# EAGLE design dual_brushed_rc_2 (EAGLE 6.6.0)

## Sheet 1 of 8
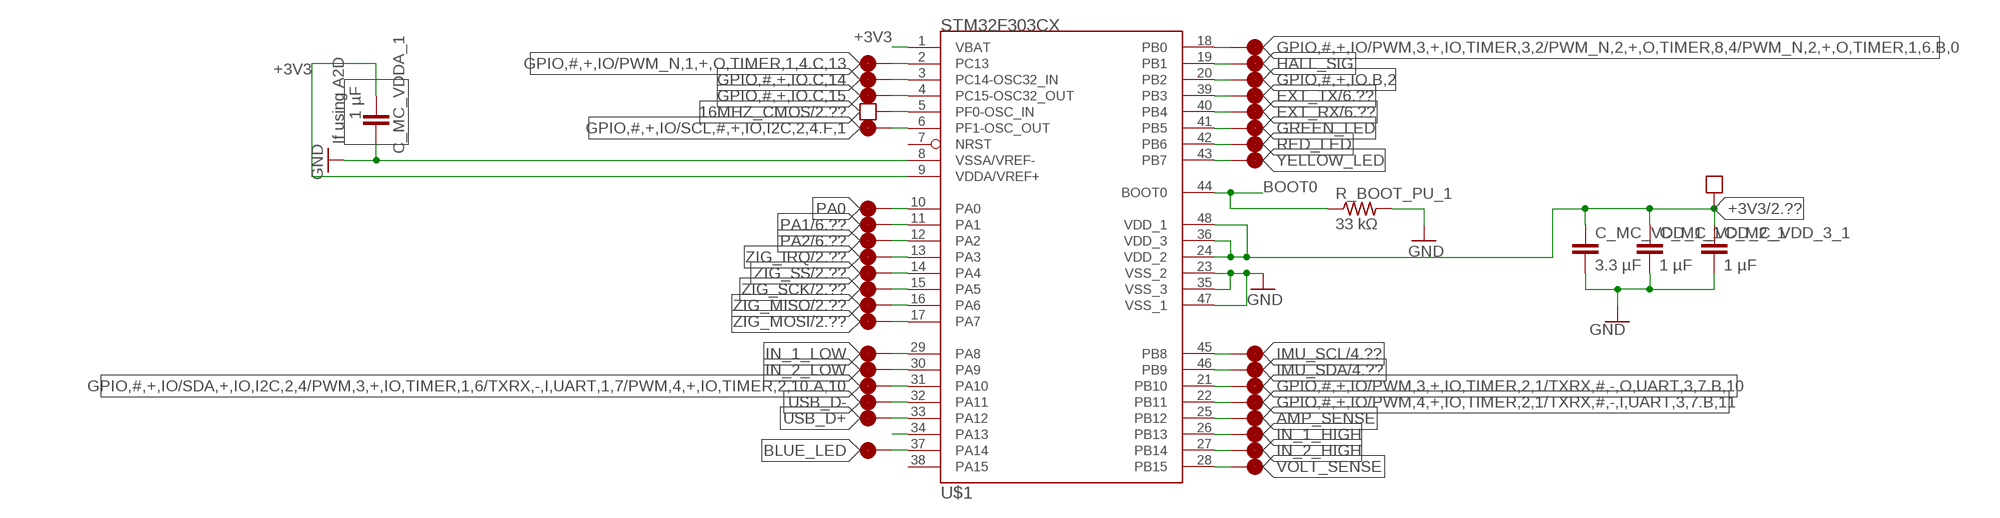
[diagram p0: schematic, sheet 1]

### Parts
C_MC_VDD_1_1  3.3 µF  C-EUC0603  [C0603]
C_MC_VDD_2_1  1 µF  C-EUC0402  [C0402]
C_MC_VDD_3_1  1 µF  C-EUC0402  [C0402]
C_MC_VDDA_1  1 µF  C-EUC0402  [C0402]
R_BOOT_PU_1  33 kΩ  R-US_R0402  [R0402]
U$1  STM32F303CX  [LQFP48]

### Nets
16MHZ_CMOS: U$1.5(PF0-OSC_IN) ; supply symbol labelled BLOCK_REQUIREMENT ; also sheet 2,3
+3V3: C_MC_VDD_1_1.1 C_MC_VDD_2_1.1 C_MC_VDD_3_1.1 C_MC_VDDA_1.1 U$1.1(VBAT) U$1.9(VDDA/VREF+) U$1.24(VDD_2) U$1.36(VDD_3) U$1.48(VDD_1) ; supply symbol labelled BLOCK_REQUIREMENT ; also sheet 2,3,4,5,6
AMP_SENSE: U$1.25(PB12) ; supply symbol labelled BLOCK_CONNECTOR ; also sheet 5
BLUE_LED: U$1.37(PA14) ; supply symbol labelled BLOCK_CONNECTOR ; also sheet 8
BOOT0: R_BOOT_PU_1.1 U$1.44(BOOT0) ; also sheet 7
EXT_RX: U$1.40(PB4) ; supply symbol labelled BLOCK_CONNECTOR ; also sheet 6
EXT_TX: U$1.39(PB3) ; supply symbol labelled BLOCK_CONNECTOR ; also sheet 6
GND: C_MC_VDD_1_1.2 C_MC_VDD_2_1.2 C_MC_VDD_3_1.2 C_MC_VDDA_1.2 R_BOOT_PU_1.2 U$1.8(VSSA/VREF-) U$1.23(VSS_2) U$1.35(VSS_3) U$1.47(VSS_1) ; also sheet 2,3,4,5,6,7,8
GPIO,#,+,IO.B,2: U$1.20(PB2) ; supply symbol labelled BLOCK_CONNECTOR
GPIO,#,+,IO.C,14: U$1.3(PC14-OSC32_IN) ; supply symbol labelled BLOCK_CONNECTOR
GPIO,#,+,IO.C,15: U$1.4(PC15-OSC32_OUT) ; supply symbol labelled BLOCK_CONNECTOR
GPIO,#,+,IO/PWM,3,+,IO,TIMER,2,1/TXRX,#,-,O,UART,3,7.B,10: U$1.21(PB10) ; supply symbol labelled BLOCK_CONNECTOR
GPIO,#,+,IO/PWM,3,+,IO,TIMER,3,2/PWM_N,2,+,O,TIMER,8,4/PWM_N,2,+,O,TIMER,1,6.B,0: U$1.18(PB0) ; supply symbol labelled BLOCK_CONNECTOR
GPIO,#,+,IO/PWM,4,+,IO,TIMER,2,1/TXRX,#,-,I,UART,3,7.B,11: U$1.22(PB11) ; supply symbol labelled BLOCK_CONNECTOR
GPIO,#,+,IO/PWM_N,1,+,O,TIMER,1,4.C,13: U$1.2(PC13) ; supply symbol labelled BLOCK_CONNECTOR
GPIO,#,+,IO/SCL,#,+,IO,I2C,2,4.F,1: U$1.6(PF1-OSC_OUT) ; supply symbol labelled BLOCK_CONNECTOR
GPIO,#,+,IO/SDA,+,IO,I2C,2,4/PWM,3,+,IO,TIMER,1,6/TXRX,-,I,UART,1,7/PWM,4,+,IO,TIMER,2,10.A,10: U$1.31(PA10) ; supply symbol labelled BLOCK_CONNECTOR
GREEN_LED: U$1.41(PB5) ; supply symbol labelled BLOCK_CONNECTOR ; also sheet 8
HALL_SIG: U$1.19(PB1) ; supply symbol labelled BLOCK_CONNECTOR ; also sheet 6
IMU_SCL: U$1.45(PB8) ; supply symbol labelled BLOCK_CONNECTOR ; also sheet 4
IMU_SDA: U$1.46(PB9) ; supply symbol labelled BLOCK_CONNECTOR ; also sheet 4
IN_1_HIGH: U$1.26(PB13) ; supply symbol labelled BLOCK_CONNECTOR ; also sheet 5
IN_1_LOW: U$1.29(PA8) ; supply symbol labelled BLOCK_CONNECTOR ; also sheet 5
IN_2_HIGH: U$1.27(PB14) ; supply symbol labelled BLOCK_CONNECTOR ; also sheet 5
IN_2_LOW: U$1.30(PA9) ; supply symbol labelled BLOCK_CONNECTOR ; also sheet 5
N$15: U$1.34(PA13)
PA0: U$1.10(PA0) ; supply symbol labelled BLOCK_CONNECTOR
PA1: U$1.11(PA1) ; supply symbol labelled BLOCK_CONNECTOR ; also sheet 6
PA2: U$1.12(PA2) ; supply symbol labelled BLOCK_CONNECTOR ; also sheet 6
RED_LED: U$1.42(PB6) ; supply symbol labelled BLOCK_CONNECTOR ; also sheet 8
USB_D+: U$1.33(PA12) ; supply symbol labelled BLOCK_CONNECTOR ; also sheet 7
USB_D-: U$1.32(PA11) ; supply symbol labelled BLOCK_CONNECTOR ; also sheet 7
VOLT_SENSE: U$1.28(PB15) ; supply symbol labelled BLOCK_CONNECTOR ; also sheet 6
YELLOW_LED: U$1.43(PB7) ; supply symbol labelled BLOCK_CONNECTOR ; also sheet 8
ZIG_IRQ: U$1.13(PA3) ; supply symbol labelled BLOCK_CONNECTOR ; also sheet 2
ZIG_MISO: U$1.16(PA6) ; supply symbol labelled BLOCK_CONNECTOR ; also sheet 2
ZIG_MOSI: U$1.17(PA7) ; supply symbol labelled BLOCK_CONNECTOR ; also sheet 2
ZIG_SCK: U$1.15(PA5) ; supply symbol labelled BLOCK_CONNECTOR ; also sheet 2
ZIG_SS: U$1.14(PA4) ; supply symbol labelled BLOCK_CONNECTOR ; also sheet 2
Unconnected: U$1.7(NRST) U$1.38(PA15)

### Notes on the sheet
- If using A2D

## Sheet 2 of 8
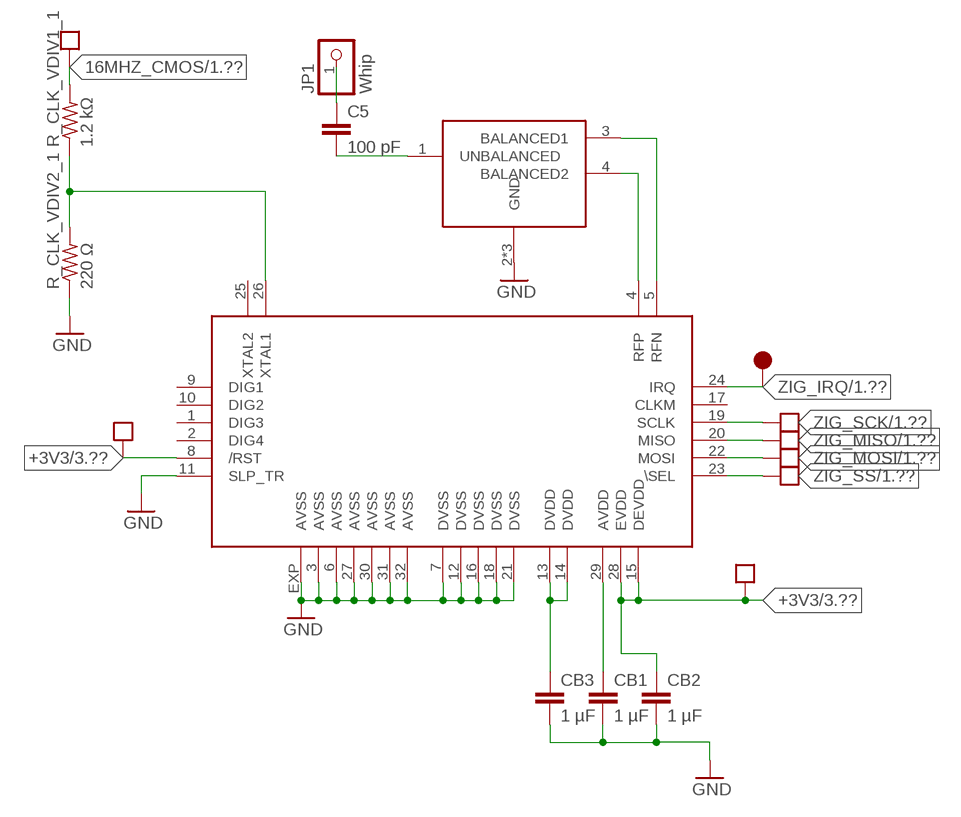
[diagram p1: schematic, sheet 2]

### Parts
BALUN1  0896FB15A0100  [0896FB15A0100]
C5  100 pF  C-EUC0402  [C0402]
CB1  1 µF  C-EUC0402  [C0402]
CB2  1 µF  C-EUC0402  [C0402]
CB3  1 µF  C-EUC0402  [C0402]
JP1  Whip  PINHD-1X01_2.54  [1X01]
R_CLK_VDIV1_1  1.2 kΩ  R-US_R0402  [R0402]
R_CLK_VDIV2_1  220 Ω  R-US_R0402  [R0402]
U$51  AT86RF  [QFNN32]

### Nets
16MHZ_0V5_1: R_CLK_VDIV1_1.1 R_CLK_VDIV2_1.2 U$51.26(XTAL1)
16MHZ_CMOS: R_CLK_VDIV1_1.2 ; supply symbol labelled BLOCK_REQUIREMENT ; also sheet 1,3
+3V3: CB2.1 U$51.8(/RST) U$51.15(DEVDD) U$51.28(EVDD) ; supply symbol labelled BLOCK_REQUIREMENT ; also sheet 1,3,4,5,6
GND: BALUN1.2(GND) BALUN1.5(GND) BALUN1.6(GND) CB1.2 CB2.2 CB3.2 R_CLK_VDIV2_1.1 U$51.3(AVSS) U$51.6(AVSS) U$51.7(DVSS) U$51.11(SLP_TR) U$51.12(DVSS) U$51.16(DVSS) U$51.18(DVSS) U$51.21(DVSS) U$51.27(AVSS) U$51.30(AVSS) U$51.31(AVSS) U$51.32(AVSS) U$51.EXP(AVSS) ; also sheet 1,3,4,5,6,7,8
N$2: BALUN1.1(UNBALANCED) C5.2
N$3: C5.1 JP1.1
N$4: CB3.1 U$51.13(DVDD) U$51.14(DVDD)
N$6: CB1.1 U$51.29(AVDD)
N$8: BALUN1.4(BALANCED2) U$51.4(RFP)
N$9: BALUN1.3(BALANCED1) U$51.5(RFN)
ZIG_IRQ: U$51.24(IRQ) ; supply symbol labelled BLOCK_CONNECTOR ; also sheet 1
ZIG_MISO: U$51.20(MISO) ; supply symbol labelled BLOCK_REQUIREMENT ; also sheet 1
ZIG_MOSI: U$51.22(MOSI) ; supply symbol labelled BLOCK_REQUIREMENT ; also sheet 1
ZIG_SCK: U$51.19(SCLK) ; supply symbol labelled BLOCK_REQUIREMENT ; also sheet 1
ZIG_SS: U$51.23(\SEL) ; supply symbol labelled BLOCK_REQUIREMENT ; also sheet 1
Unconnected: U$51.1(DIG3) U$51.2(DIG4) U$51.9(DIG1) U$51.10(DIG2) U$51.17(CLKM) U$51.25(XTAL2)

## Sheet 3 of 8
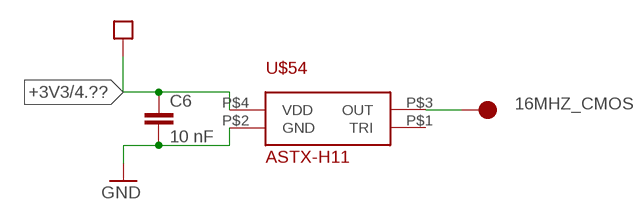
[diagram p2: schematic, sheet 3]

### Parts
C6  10 nF  C-EUC0402  [C0402]
U$54  ASTX-H11  [ASTX-H11]

### Nets
16MHZ_CMOS: U$54.P$3(OUT) ; supply symbol labelled BLOCK_CONNECTOR ; also sheet 1,2
+3V3: C6.1 U$54.P$4(VDD) ; supply symbol labelled BLOCK_REQUIREMENT ; also sheet 1,2,4,5,6
GND: C6.2 U$54.P$2(GND) ; also sheet 1,2,4,5,6,7,8
Unconnected: U$54.P$1(TRI)

## Sheet 4 of 8: IMU
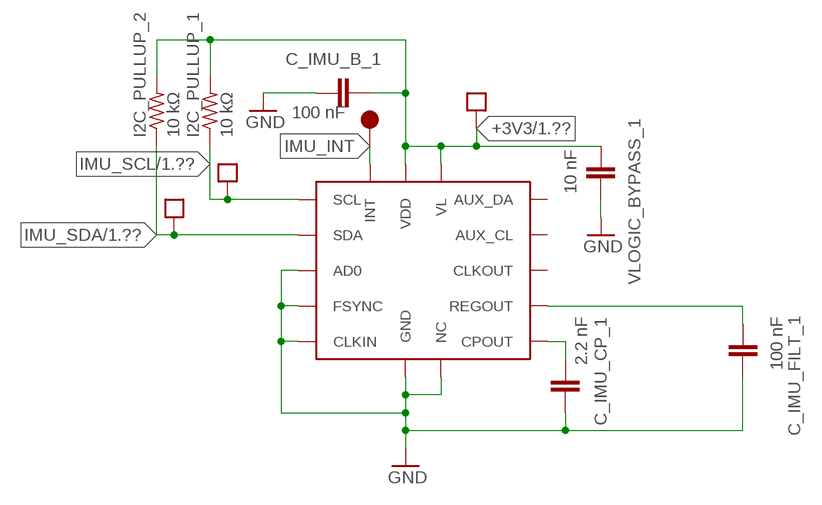
[diagram p3: schematic, sheet 4]

### Parts
C_IMU_B_1  100 nF  C-EUC0402  [C0402]
C_IMU_CP_1  2.2 nF  C-EUC0402  [C0402]
C_IMU_FILT_1  100 nF  C-EUC0402  [C0402]
I2C_PULLUP_1  10 kΩ  R-US_R0402  [R0402]
I2C_PULLUP_2  10 kΩ  R-US_R0402  [R0402]
U$46  MPU-6050  [QFN24]
VLOGIC_BYPASS_1  10 nF  C-EUC0402  [C0402]

### Nets
+3V3: C_IMU_B_1.1 I2C_PULLUP_1.2 I2C_PULLUP_2.2 U$46.P$8(VL) U$46.P$13(VDD) VLOGIC_BYPASS_1.1 ; supply symbol labelled BLOCK_REQUIREMENT ; also sheet 1,2,3,5,6
GND: C_IMU_B_1.2 C_IMU_CP_1.2 C_IMU_FILT_1.2 U$46.P$1(CLKIN) U$46.P$2(NC) U$46.P$3(NC) U$46.P$4(NC) U$46.P$5(NC) U$46.P$9(AD0) U$46.P$11(FSYNC) U$46.P$14(NC) U$46.P$15(NC) U$46.P$16(NC) U$46.P$17(NC) U$46.P$18(GND) U$46.P$25(GND) VLOGIC_BYPASS_1.2 ; also sheet 1,2,3,5,6,7,8
IMU_INT: U$46.P$12(INT) ; supply symbol labelled BLOCK_CONNECTOR
IMU_SCL: I2C_PULLUP_1.1 U$46.P$23(SCL) ; supply symbol labelled BLOCK_REQUIREMENT ; also sheet 1
IMU_SDA: I2C_PULLUP_2.1 U$46.P$24(SDA) ; supply symbol labelled BLOCK_REQUIREMENT ; also sheet 1
N$5: C_IMU_CP_1.1 U$46.P$20(CPOUT)
REGOUT_1: C_IMU_FILT_1.1 U$46.P$10(REGOUT)
Unconnected: U$46.P$6(AUX_DA) U$46.P$7(AUX_CL) U$46.P$22(CLKOUT)

## Sheet 5 of 8
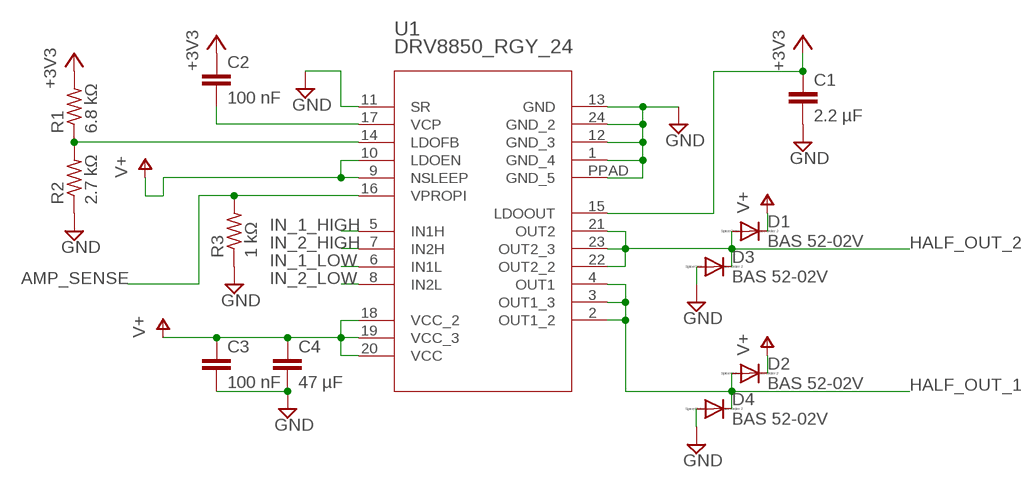
[diagram p4: schematic, sheet 5]

### Parts
C1  2.2 µF  C-EUC0603  [C0603]
C2  100 nF  C-EUC0402  [C0402]
C3  100 nF  C-EUC0402  [C0402]
C4  47 µF  C-EUC0805  [C0805]
D1  BAS 52-02V  DIODE-SOD523  [SOD523]
D2  BAS 52-02V  DIODE-SOD523  [SOD523]
D3  BAS 52-02V  DIODE-SOD523  [SOD523]
D4  BAS 52-02V  DIODE-SOD523  [SOD523]
R1  6.8 kΩ  R-US_R0402  [R0402]
R2  2.7 kΩ  R-US_R0402  [R0402]
R3  1 kΩ  R-US_R0402  [R0402]
U1  DRV8850_RGY_24  [RGY_24]

### Nets
+3V3: C1.1 C2.1 R1.2 U1.15(LDOOUT) ; also sheet 1,2,3,4,6
AMP_SENSE: R3.2 U1.16(VPROPI) ; also sheet 1
GND: C1.2 C3.2 C4.2 D3.A D4.A R2.1 R3.1 U1.1(GND_4) U1.11(SR) U1.12(GND_3) U1.13(GND) U1.24(GND_2) U1.PPAD(GND_5) ; also sheet 1,2,3,4,6,7,8
HALF_OUT_1: D2.A D4.C U1.2(OUT1_2) U1.3(OUT1_3) U1.4(OUT1) ; also sheet 6
HALF_OUT_2: D1.A D3.C U1.21(OUT2) U1.22(OUT2_2) U1.23(OUT2_3) ; also sheet 6
IN_1_HIGH: U1.5(IN1H) ; also sheet 1
IN_1_LOW: U1.6(IN1L) ; also sheet 1
IN_2_HIGH: U1.7(IN2H) ; also sheet 1
IN_2_LOW: U1.8(IN2L) ; also sheet 1
N$1: R1.1 R2.2 U1.14(LDOFB)
N$7: C2.2 U1.17(VCP)
V+: C3.1 C4.1 D1.C D2.C U1.9(NSLEEP) U1.10(LDOEN) U1.18(VCC_2) U1.19(VCC_3) U1.20(VCC) ; also sheet 6,7

## Sheet 6 of 8
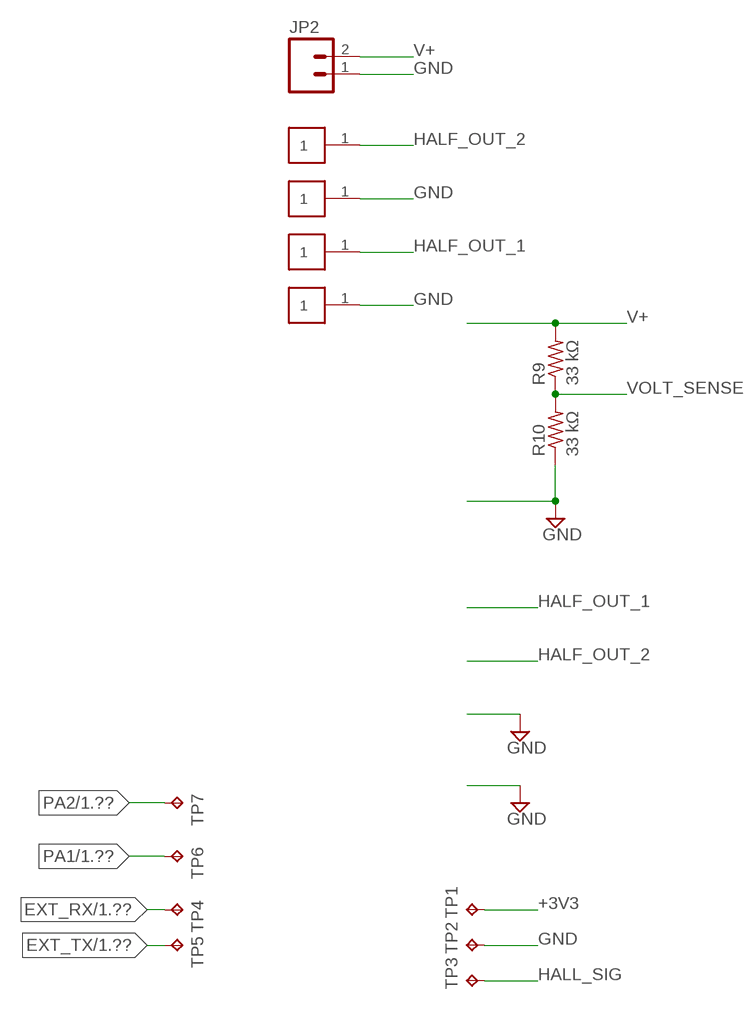
[diagram p5: schematic, sheet 6]

### Parts
JP2  M02-JST-2-PTH-NO_SILK  [JST-2-PTH-NS]
R9  33 kΩ  R-US_R0402  [R0402]
R10  33 kΩ  R-US_R0402  [R0402]
TP1  TPTP10SQ  [TP10SQ]
TP2  TPTP10SQ  [TP10SQ]
TP3  TPTP10SQ  [TP10SQ]
TP4  TPTP10SQ  [TP10SQ]
TP5  TPTP10SQ  [TP10SQ]
TP6  TPTP10SQ  [TP10SQ]
TP7  TPTP10SQ  [TP10SQ]
U$55  PADSURF  [PAD_1_SURF]
U$58  PADSURF  [PAD_1_SURF]
U$59  PADSURF  [PAD_1_SURF]
U$60  PADSURF  [PAD_1_SURF]

### Nets
+3V3: TP1.TP ; also sheet 1,2,3,4,5
EXT_RX: TP4.TP ; also sheet 1
EXT_TX: TP5.TP ; also sheet 1
GND: JP2.1 R10.1 TP2.TP U$59.1 U$60.1 ; also sheet 1,2,3,4,5,7,8
HALF_OUT_1: U$58.1 ; also sheet 5
HALF_OUT_2: U$55.1 ; also sheet 5
HALL_SIG: TP3.TP ; also sheet 1
PA1: TP6.TP ; also sheet 1
PA2: TP7.TP ; also sheet 1
V+: JP2.2 R9.2 ; also sheet 5,7
VOLT_SENSE: R9.1 R10.2 ; also sheet 1

## Sheet 7 of 8
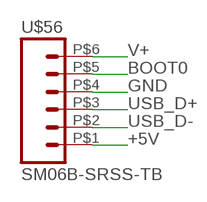
[diagram p6: schematic, sheet 7]

### Parts
U$56  SM06B-SRSS-TB  [SM06B-SRSS-TB]

### Nets
+5V: U$56.P$1
BOOT0: U$56.P$5 ; also sheet 1
GND: U$56.P$4 ; also sheet 1,2,3,4,5,6,8
USB_D+: U$56.P$3 ; also sheet 1
USB_D-: U$56.P$2 ; also sheet 1
V+: U$56.P$6 ; also sheet 5,6

## Sheet 8 of 8
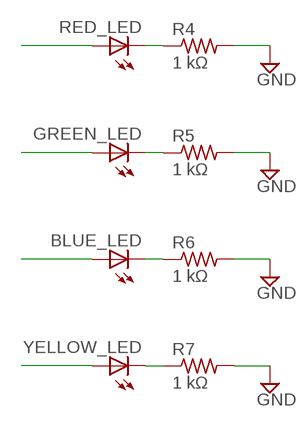
[diagram p7: schematic, sheet 8]

### Parts
BLUE_LED  LEDCHIPLED_0603  [CHIPLED_0603]
GREEN_LED  LEDCHIPLED_0603  [CHIPLED_0603]
R4  1 kΩ  R-US_R0402  [R0402]
R5  1 kΩ  R-US_R0402  [R0402]
R6  1 kΩ  R-US_R0402  [R0402]
R7  1 kΩ  R-US_R0402  [R0402]
RED_LED  LEDCHIPLED_0603  [CHIPLED_0603]
YELLOW_LED  LEDCHIPLED_0603  [CHIPLED_0603]

### Nets
BLUE_LED: BLUE_LED.A ; also sheet 1
GND: R4.2 R5.2 R6.2 R7.2 ; also sheet 1,2,3,4,5,6,7
GREEN_LED: GREEN_LED.A ; also sheet 1
N$10: R4.1 RED_LED.C
N$12: GREEN_LED.C R5.1
N$14: BLUE_LED.C R6.1
N$17: R7.1 YELLOW_LED.C
RED_LED: RED_LED.A ; also sheet 1
YELLOW_LED: YELLOW_LED.A ; also sheet 1

## Library data of the parts
BALUN1 = piccoli:0896FB15A0100
BLUE_LED GREEN_LED RED_LED YELLOW_LED = led:LED: LED OSRAM: - CHIPLED LG R971, LG N971, LY N971, LG Q971, LY Q971, LO R971, LY R971 LH N974, LH R974 LS Q976, LO Q976, LY Q976 LO Q996 - Hyper CHIPLED LW Q18S LB Q993, LB Q99A, LB R99A - SideLED LS A670, LO A670, LY A670, LG A670, LP A670 LB A673, LV A673, LT A673, LW A673 LH A674 LY A675 LS A676, LA A676, LO A676, LY A676, LW A676 LS A679, LY A679, LG A679 - Hyper Micro SIDELED® LS Y876, LA Y876, LO Y876, LY Y876 LT Y87S - SmartLED LW L88C, LW L88S LB L89C, LB L89S, LG L890 LS L89K, LO L89K, LY L89K LS L896, LA L896, LO L896, LY L896 - TOPLED LS T670, LO T670, LY T670, LG T670, LP T670 LSG T670, LSP T670, LSY T670, LOP T670, LYG T670 LG T671, LOG T671, LSG T671 LB T673, LV T673, LT T673, LW T673 LH T674 LS T676, LA T676, LO T676, LY T676, LB T676, LH T676, LSB T676, LW T676 LB T67C, LV T67C, LT T67C, LS T67K, LO T67K, LY T67K, LW E67C LS E67B, LA E67B, LO E67B, LY E67B, LB E67C, LV E67C, LT E67C LW T67C LS T679, LY T679, LG T679 LS T770, LO T770, LY T770, LG T770, LP T770 LB T773, LV T773, LT T773, LW T773 LH T774 LS E675, LA E675, LY E675, LS T675 LS T776, LA T776, LO T776, LY T776, LB T776 LHGB T686 LT T68C, LB T68C - Hyper Mini TOPLED® LB M676 - Mini TOPLED Santana® LG M470 LS M47K, LO M47K, LY M47K Source: http://www.osram.convergy.de LUXEON: - LUMILED® LXK2-PW12-R00, LXK2-PW12-S00, LXK2-PW14-U00, LXK2-PW14-V00 LXK2-PM12-R00, LXK2-PM12-S00, LXK2-PM14-U00 LXK2-PE12-Q00, LXK2-PE12-R00, LXK2-PE12-S00, LXK2-PE14-T00, LXK2-PE14-U00 LXK2-PB12-K00, LXK2-PB12-L00, LXK2-PB12-M00, LXK2-PB14-N00, LXK2-PB14-P00, LXK2-PB14-Q00 LXK2-PR12-L00, LXK2-PR12-M00, LXK2-PR14-Q00, LXK2-PR14-R00 LXK2-PD12-Q00, LXK2-PD12-R00, LXK2-PD12-S00 LXK2-PH12-R00, LXK2-PH12-S00 LXK2-PL12-P00, LXK2-PL12-Q00, LXK2-PL12-R00 Source: www.luxeon.com KINGBRIGHT: KA-3528ASYC Source: www.kingbright.com
C1-C6 C_IMU_B_1 C_IMU_CP_1 C_IMU_FILT_1 C_MC_VDD_1_1 C_MC_VDD_2_1 C_MC_VDD_3_1 C_MC_VDDA_1 CB1-CB3 VLOGIC_BYPASS_1 = rcl:C-EU: CAPACITOR, European symbol
D1-D4 = diode:DIODE-: DIODE
I2C_PULLUP_1 I2C_PULLUP_2 R_BOOT_PU_1 R_CLK_VDIV1_1 R_CLK_VDIV2_1 = resistor:R-US_: RESISTOR, American symbol
JP1 = pinhead-2:PINHD-1X01: PIN HEADER
JP2 = SparkFun:M02: Header 2 Standard 2-pin 0.1" header. Use with straight break away headers (SKU : PRT-00116), right angle break away headers (PRT-00553), swiss pins (PRT-00743), machine pins (PRT-00117), and female headers (PRT-00115). Molex polarized connector foot print use with SKU : PRT-08233 with associated crimp pins and housings.
R1-R7 R9 R10 = rcl:R-US_: RESISTOR, American symbol
TP1-TP7 = testpad:TP: Test pad
U1 = block_parts:DRV8850_RGY_24: The DRV8850 from Texas Instruments is a Low-Voltage H-bridge IC With LDO Voltage Regulation.; MANUFACTURER_PART_NUMBER: drv8850_rgy_24; VENDOR: Texas Instruments
U$1 = piccoli:STM32F303CX
U$46 = zz-upenn 2:MPU-6050
U$51 = piccoli:AT86RF
U$54 = block_parts:ASTX-H11
U$55 U$58-U$60 = block_parts:PAD
U$56 = block_parts:SM06B-SRSS-TB

## Board
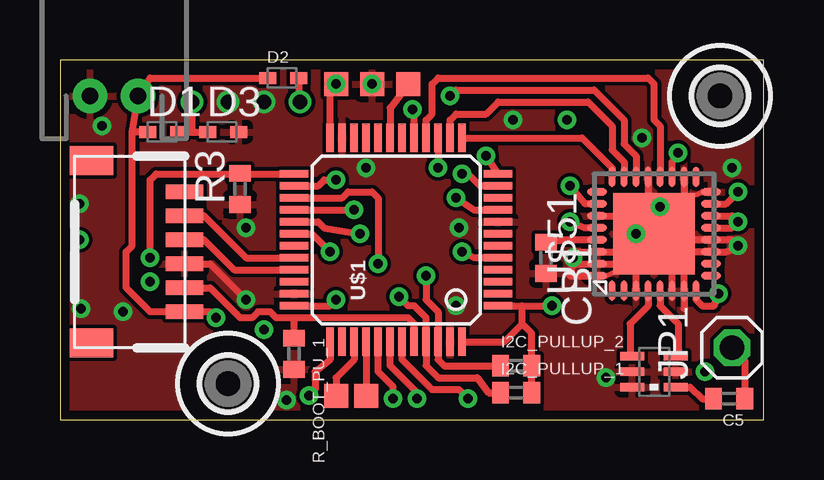
[diagram p8: board, top side]
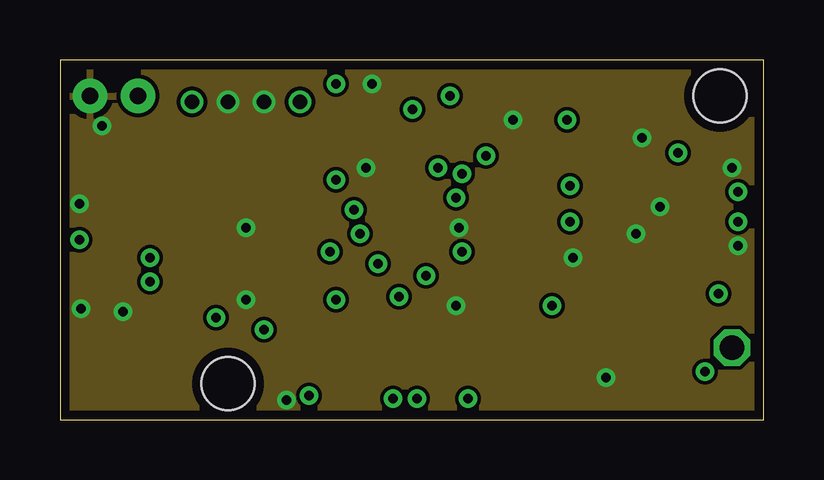
[diagram p9: board, inner layer Route2]
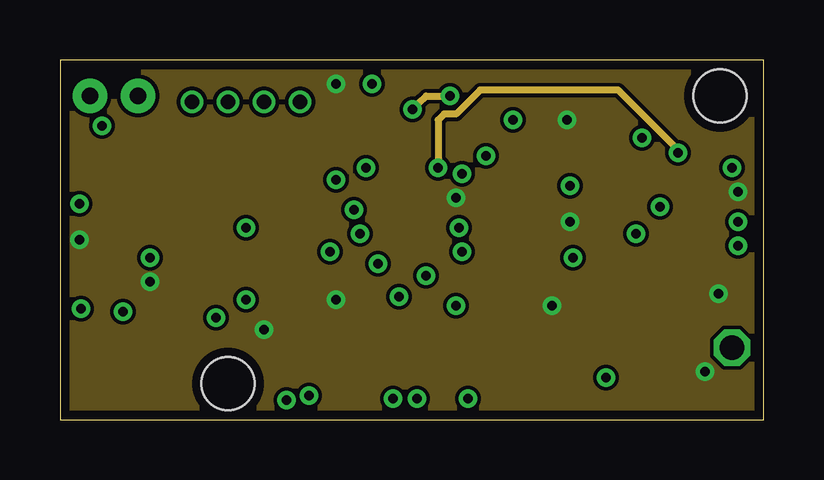
[diagram p10: board, inner layer Route15]
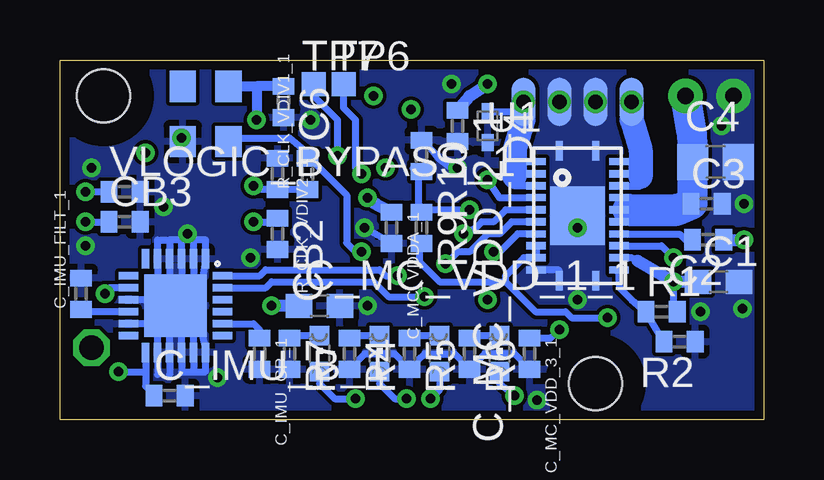
[diagram p11: board, bottom side, seen from below]

Size 29.31 x 15 mm. Coordinates in mm from the lower left corner, seen from the top.
Outline: 0,0 29.31,0 29.31,15 0,15 0,0
Copper layers (1*2+15*16): Top 0.0356mm / dielectric 1.5011mm / Route2 0.0356mm / dielectric 0.1499mm / Route15 0.0356mm / dielectric 0.2007mm / Bottom 0.0356mm
Design rules "OSH_Park_4-Layer_2014-10-10": minimum track width 6mil, minimum drill 13mil, track to track 6mil, track to pad 6mil, pad to pad 6mil, via to via 6mil, smd to smd 6mil, copper to edge 15mil, drill to drill 6mil, minimum pad ring 7mil, minimum via ring 7mil, stop-mask expansion 3mil, vias tented up to drill 0mil, thermal gap 10mil
tRestrict: area 24.2,3 to 25.2,4.2

### Footprints (pad centres in the part's own frame; a part is rotated, then mirrored left to right if it is on the bottom)
0896FB15A0100 = smd 0.35 x 1: 1 -0.65,-0.9; 2 0,-0.9; 3 0.65,-0.9; 4 0.65,0.9; 5 0,0.9; 6 -0.65,0.9
CHIPLED_0603 = smd 0.8 x 0.8: A 0,-0.75; C 0,0.75
C0603 = smd 1.1 x 1: 1 -0.85,0; 2 0.85,0
C0402 = smd 0.7 x 0.9: 1 -0.65,0; 2 0.65,0
C0805 = smd 1.3 x 1.5: 1 -0.95,0; 2 0.95,0
SOD523 = smd 0.7 x 0.5: A 0.7,0; C -0.6,0
R0402 = smd 0.7 x 0.9: 1 -0.65,0; 2 0.65,0
1X01 = drill 1.016 octagon: 1 0,0
JST-2-PTH-NS = drill 0.7 pad 1.448: 1 -1,0; 2 1,0
TP10SQ = smd 1 x 1: TP 0,0
RGY_24 = smd 0.305 x 0.813: 1 -0.762,2.718; 12 -0.762,-2.718; 13 0.762,-2.718; 24 0.762,2.718 | smd 0.813 x 0.305: 2 -1.727,2.261; 3 -1.727,1.753; 4 -1.727,1.245; 5 -1.727,0.762; 6 -1.727,0.254; 7 -1.727,-0.254; 8 -1.727,-0.762; 9 -1.727,-1.245; 10 -1.727,-1.753; 11 -1.727,-2.261; 14 1.727,-2.261; 15 1.727,-1.753; 16 1.727,-1.245; 17 1.727,-0.762; 18 1.727,-0.254; 19 1.727,0.254; 20 1.727,0.762; 21 1.727,1.245; 22 1.727,1.753; 23 1.727,2.261 | smd 2.26 x 2.44: PPAD 0,0
LQFP48 = smd 0.3 x 1.2: 1 -2.75,-4.25; 2 -2.25,-4.25; 3 -1.75,-4.25; 4 -1.25,-4.25; 5 -0.75,-4.25; 6 -0.25,-4.25; 7 0.25,-4.25; 8 0.75,-4.25; 9 1.25,-4.25; 10 1.75,-4.25; 11 2.25,-4.25; 12 2.75,-4.25; 25 2.75,4.25; 26 2.25,4.25; 27 1.75,4.25; 28 1.25,4.25; 29 0.75,4.25; 30 0.25,4.25; 31 -0.25,4.25; 32 -0.75,4.25; 33 -1.25,4.25; 34 -1.75,4.25; 35 -2.25,4.25; 36 -2.75,4.25 | smd 1.2 x 0.3: 13 4.25,-2.75; 14 4.25,-2.25; 15 4.25,-1.75; 16 4.25,-1.25; 17 4.25,-0.75; 18 4.25,-0.25; 19 4.25,0.25; 20 4.25,0.75; 21 4.25,1.25; 22 4.25,1.75; 23 4.25,2.25; 24 4.25,2.75; 37 -4.25,2.75; 38 -4.25,2.25; 39 -4.25,1.75; 40 -4.25,1.25; 41 -4.25,0.75; 42 -4.25,0.25; 43 -4.25,-0.25; 44 -4.25,-0.75; 45 -4.25,-1.25; 46 -4.25,-1.75; 47 -4.25,-2.25; 48 -4.25,-2.75
QFN24 = smd 0.3 x 0.8: P$1 -1.25,-1.955; P$2 -0.75,-1.955; P$3 -0.25,-1.955; P$4 0.25,-1.955; P$5 0.75,-1.955; P$6 1.25,-1.955; P$13 1.25,1.955; P$14 0.75,1.955; P$15 0.25,1.955; P$16 -0.25,1.955; P$17 -0.75,1.955; P$18 -1.25,1.955 | smd 0.8 x 0.3: P$7 1.955,-1.25; P$8 1.955,-0.75; P$9 1.955,-0.25; P$10 1.955,0.25; P$11 1.955,0.75; P$12 1.955,1.25; P$19 -1.955,1.25; P$20 -1.955,0.75; P$21 -1.955,0.25; P$22 -1.955,-0.25; P$23 -1.955,-0.75; P$24 -1.955,-1.25 | smd 2.6 x 2.6: P$25 0,0
QFNN32 = smd 0.85 x 0.3: 1 -2.375,1.75; 2 -2.375,1.25; 3 -2.375,0.75; 4 -2.375,0.25; 5 -2.375,-0.25; 6 -2.375,-0.75; 7 -2.375,-1.25; 8 -2.375,-1.75; 17 2.375,-1.75; 18 2.375,-1.25; 19 2.375,-0.75; 20 2.375,-0.25; 21 2.375,0.25; 22 2.375,0.75; 23 2.375,1.25; 24 2.375,1.75 | smd 0.3 x 0.85: 9 -1.75,-2.375; 10 -1.25,-2.375; 11 -0.75,-2.375; 12 -0.25,-2.375; 13 0.25,-2.375; 14 0.75,-2.375; 15 1.25,-2.375; 16 1.75,-2.375; 25 1.75,2.375; 26 1.25,2.375; 27 0.75,2.375; 28 0.25,2.375; 29 -0.25,2.375; 30 -0.75,2.375; 31 -1.25,2.375; 32 -1.75,2.375 | smd 3.4 x 3.4: EXP 0,0
M2_HOLE_PLASTIC = hole 2.2: 0,0
ASTX-H11 = smd 1.3 x 1.1: P$1 -1.15,-0.95; P$2 1.15,-0.95; P$3 1.15,0.95; P$4 -1.15,0.95
PAD_1_SURF = smd 2 x 1: 1 0,0
SM06B-SRSS-TB = smd 0.6 x 1.55: P$1 -2.5,0; P$2 -1.5,0; P$3 -0.5,0; P$4 0.5,0; P$5 1.5,0; P$6 2.5,0 | smd 1.2 x 1.8: P$7 3.8,-3.875; P$8 -3.8,-3.875

### Placement (x,y rotation side)
BALUN1  24.75,2 90 top
BLUE_LED  11,2.75 0 bottom
C1  1.88,5.75 0 bottom
C2  2.31,7.5 180 bottom
C3  2.38,9 0 bottom
C4  2,10.75 0 bottom
C5  27.88,0.88 180 top
C6  20,13.25 270 bottom
C_IMU_B_1  24.75,1 0 bottom
C_IMU_CP_1  21,2.75 270 bottom
C_IMU_FILT_1  28.44,5.25 90 bottom
C_MC_VDD_1_1  18.5,4.75 0 bottom
C_MC_VDD_2_1  12.75,12.25 270 bottom
C_MC_VDD_3_1  9.75,2.75 270 bottom
C_MC_VDDA_1  15.5,8 270 bottom
CB1  20.25,6.75 270 top
CB2  20.25,7.75 270 bottom
CB3  26.62,8.25 0 bottom
D1  4.25,12 0 top
D2  9.25,14.25 0 top
D3  6.75,12 0 top
D4  11.5,12.25 270 bottom
GREEN_LED  13.5,2.75 0 bottom
I2C_PULLUP_1  19,1.12 0 top
I2C_PULLUP_2  19,2.25 0 top
JP1  28,3 90 top
JP2  2.25,13.5 0 top
R1  4.25,4.5 0 bottom
R2  3.5,3.25 180 bottom
R3  7.5,9.62 90 top
R4  17.25,2.75 270 bottom
R5  14.75,2.75 270 bottom
R6  12.25,2.75 270 bottom
R7  19.75,2.75 270 bottom
R9  14.25,8 270 bottom
R10  14.25,11 270 bottom
R_BOOT_PU_1  9.75,2.75 270 top
R_CLK_VDIV1_1  19,10.25 90 bottom
R_CLK_VDIV2_1  20.25,10.25 270 bottom
RED_LED  16,2.75 0 bottom
TP1  11.5,14 0 top
TP2  13,14 0 top
TP3  14.5,14 0 top
TP4  12.75,1 0 top
TP5  11.5,1 0 top
TP6  17.5,14 0 bottom
TP7  18.75,14 0 bottom
U1  7.75,8.5 0 bottom
U$1  14,7.5 90 top
U$46  24.5,4.75 180 bottom
U$51  24.75,7.75 90 top
U$52  [M2_HOLE_PLASTIC]  27.5,13.5 0 top
U$54  23.25,12.75 270 bottom
U$55  5.5,13.25 90 bottom
U$56  5.19,7 270 top
U$57  [M2_HOLE_PLASTIC]  7,1.5 0 top
U$58  10,13.25 90 bottom
U$59  7,13.25 90 bottom
U$60  8.5,13.25 90 bottom
VLOGIC_BYPASS_1  26.62,9.5 0 bottom
YELLOW_LED  18.5,2.75 0 bottom

### Tracks (layer width: path | path; a pad name or v marks a point on that pad's centre or on a via)
16MHZ_0V5_1  (via drill 0.4)
  Top 0.3: U$51.26 21.88,9 v21.25,9.75
  Bottom 0.3: R_CLK_VDIV1_1.1 R_CLK_VDIV2_1.2 21.1,9.6 v21.25,9.75
16MHZ_CMOS  (via drill 0.4)
  Top 0.3: U$1.5 17.25,6.75 v16.75,7
  Bottom 0.3: U$54.P$3 22.3,11.75 19.75,11.75 19,11.12 R_CLK_VDIV1_1.2 18.75,10.75 17.38,9.38 17.38,7.38 17,7 v16.75,7
+3V3  (via drill 0.4)
  Top 0.3: U$51.8 26.5,5 26.75,4.75 27.25,4.75 v27.44,5.25 | v16.5,9.25 17.25,8.75 U$1.9 | U$51.28 21.88,8 v21.25,8.25 | U$1.36 11.25,4.75 v11.5,5 | U$1.24 11.25,13.75 TP1.TP | U$1.48 18.5,3.25 19.25,4 | U$1.1 19.25,4.75 | 19.25,4.75 v20.5,4.75 | 19.25,4 19.25,4.75 | I2C_PULLUP_1.2 I2C_PULLUP_2.2 19.65,3.6 19.25,4 | U$51.15 27.75,9 v28.25,9.5
  Bottom 0.3: 25.75,2 U$46.P$13 25.75,2.5 | 5.25,6.62 5.5,6.75 U1.15 | C_IMU_B_1.1 25.75,1.4 25.75,2 | U$46.P$8 27.25,5.5 v27.44,5.25 | v26.88,2 25.75,2 | v21.25,8.25 20.1,8.25 CB2.1 | VLOGIC_BYPASS_1.1 v28.25,9.5 | C_MC_VDD_3_1.1 8.88,3.4 v8.5,3.75 | R1.2 3.75,4.62 v3.75,5.75
  Bottom 0.406: C6.1 21.12,13.9 | 21.12,13.9 v21.12,12.5 | U$54.P$4 21.12,13.9
  Bottom 0.5: C_MC_VDD_1_1.1 v20.5,4.75 | C2.1 v0.81,7.5 | C1.1 v3.75,5.75 5.25,6.62 | C_MC_VDD_2_1.1 12.25,13.5 TP1.TP | v16.5,9.25 16.15,9 C_MC_VDDA_1.1
  other vias: 11.5,14
  pour Route15: -0.12,14.88 29.38,14.88 29.38,0.12 -0.12,0.12
AMP_SENSE  (via drill 0.4)
  Top 0.3: U$1.25 7.65,10.25 R3.2 7.47,10.25 4,10.25 3.75,10 v3.75,6.75
  Bottom 0.3: U1.16 6.27,7.25 4.25,7.25 v3.75,6.75
BLUE_LED  (via drill 0.4)
  Top 0.3: U$1.37 11.25,2.5 10.62,2 10.62,1.25 v10.38,1
  Bottom 0.3: BLUE_LED.A 11,1.5 v10.38,1
BOOT0
  Top 0.3: U$56.P$5 6.25,5.5 7.5,4.25 8,4.25 8.25,4.5 8.75,4.5 9,4.25 9.75,4.25 | U$1.44 14.75,4 14.5,4.25 9.75,4.25 | R_BOOT_PU_1.1 9.75,4.25
EXT_RX
  Top 0.3: U$1.40 TP4.TP
EXT_TX
  Top 0.3: U$1.39 12.25,2.5 11.5,1.75 TP5.TP
GND  (via drill 0.4, 0.6)
  Top 0.19: 22.75,6 23.25,6.25 | 26.75,9.5 26.5,9.38
  Top 0.2: U$51.32 22.75,6 | 23.25,6.25 23.25,6.5 | U$51.16 26.75,9.5 | 26.5,9.38 26,9.25
  Top 0.3: U$51.EXP 25,7.5 U$51.12 28,7.5 v28.25,7.25 27.75,7 U$51.11 25.5,7 | U$51.6 25.5,7 | 25.5,7 U$51.EXP | U$51.EXP 26,6.5 U$51.7 26,4.62 | U$51.3 24,7 | U$51.18 26,9.25 26,9 U$51.EXP | U$51.21 24.5,7.75 U$51.EXP | 24,7 U$51.30 21.5,7 21.38,6.88 v21.38,6.75 | U$51.27 24,8.5 U$51.EXP | 24,7 23.5,6.5 23.25,6.5 U$51.31 21.38,6.5 v21.38,6.75 | 24,7 U$51.EXP | v21.38,6.75 21.25,6 U$51.32 | U$56.P$4 6.25,6.5 v7.75,5
  Bottom 0.3: 24.75,5 U$46.P$9 | U$46.P$16 24.25,4.5 U$46.P$25 | U$46.P$16 24.25,4 U$46.P$11 | 8.51,6.24 U1.11 | U$46.P$16 24.25,2 23.75,2 | 23.75,2 23.25,2 U$46.P$18 23.25,3 23.5,4 24.5,4.5 U$46.P$25 | 23.75,2 U$46.P$17 23.75,4 U$46.P$25 | U$46.P$25 25.25,5.5 U$46.P$5 25.25,7.5 24.75,7.5 | U$46.P$4 24.75,5 | 24.75,5 U$46.P$25 | U$46.P$25 24.25,5 U$46.P$3 24.25,7.5 | U$46.P$25 23.75,5.5 U$46.P$2 23.75,7.5 | U$46.P$25 24.5,5 23.5,5.25 U$46.P$1 23.25,7.5 23.75,7.5 | 24.75,7.5 24.75,6.75 | 24.25,7.5 24.75,7.5 | 23.75,7.5 24.25,7.5 | 24.75,4.5 U$46.P$15 24.75,1.88 | 24.75,4.5 25.25,4 U$46.P$14 25.25,1.88 | 24.75,4.5 U$46.P$25 | R_BOOT_PU_1.2 10.38,2.75 11.62,2.75 R6.2 12.88,2.75 14.12,2.75 14.4,2.48 R5.2 15.38,2.75 16.62,2.75 R4.2 | C_MC_VDDA_1.2 v16.62,8 | R10.1 13.75,11.15 13.5,10.88 13,10.5 v12.75,10.5
  other vias: 9.44,0.81 0.81,9 1.75,12.25 13,14 0.88,4.62 2.62,4.5 16.5,4.75 22.75,1.75 18.88,12.5 28,10.5 8.5,13.25 7,13.25 25,8.88 7.75,8 24.25,11.75 24,7.75
  pour Bottom (rank 3): -0.06,0 29.31,0 29.31,15 -0.06,15
  pour Top: 0,15 0,0 29.31,0 29.31,15
  pour Route2: -0.12,14.88 29.38,14.88 29.38,0.12 -0.12,0.12
  pour Bottom (no thermals): -0.06,15 11,15 11,5 -0.06,5
GREEN_LED  (via drill 0.4)
  Top 0.3: v13.88,0.88 13.88,1.38 13.25,2 U$1.41
  Bottom 0.3: GREEN_LED.A 13.5,1.25 v13.88,0.88
HALF_OUT_1  (via drill 0.6)
  Top 0.3: D2.A 9.95,13.55 U$58.1
  Bottom 0.3: U1.2 10.49,10.76 10.38,10.75 | U1.4 10.37,9.74 10.37,10.12 10.38,10.12 | U1.3 10.38,10.25 | D4.C 10.35,12.85 U$58.1
  Bottom 1: 10.38,10.12 10.38,10.25 10.38,10.75 10.36,11.25 10,12.5 U$58.1
  other vias: 10,13.25
HALF_OUT_2  (via drill 0.6)
  Top 0.3: D3.C D1.A 5.5,12 U$55.1
  Bottom 0.3: U1.21 5.13,9.74 5.13,9.87 5.12,10.12 | U1.22 5.02,10.25 5.12,10.5 | 5.76,10.76 U1.23 5.01,10.76 5.12,10.75
  Bottom 1: U$55.1 5.5,12.5 5.12,11.25 5.12,10.75 5.12,10.5 5.12,10.12
  other vias: 5.5,13.25
HALL_SIG
  Top 0.3: TP3.TP 13.75,13 U$1.19
IMU_SCL  (via drill 0.4)
  Top 0.3: v14.12,5.12 14.5,4.75 14.75,4.75 15.25,4.25 U$1.45 15.25,2.25 15.75,1.75 17.38,1.75 17.85,1.12 I2C_PULLUP_1.1
  Bottom 0.3: U$46.P$23 20.75,5.5 20.5,5.75 16.25,5.75 15.62,5.12 v14.12,5.12
IMU_SDA  (via drill 0.4)
  Top 0.3: v15.25,6 15.25,5 15.75,4.5 U$1.46 15.75,2.5 16,2.25 I2C_PULLUP_2.1
  Bottom 0.3: U$46.P$24 21,6 20.75,6.25 16,6.25 15.75,6 v15.25,6
IN_1_HIGH  (via drill 0.4)
  Top 0.3: U$1.26 10.75,9.75 11,10 v11.5,10
  Bottom 0.3: U1.5 11,9.25 v11.5,10
IN_1_LOW  (via drill 0.4)
  Top 0.3: U$1.29 10.75,8.25 11,8 v12.5,7.75
  Bottom 0.3: U1.6 10.75,8.75 11.25,8.25 11.75,8.25 12,8 v12.5,7.75
IN_2_HIGH  (via drill 0.4)
  Top 0.3: U$1.27 11.75,9.25 12,9.5 13,9.5 13.25,9.25 v13.25,6.5
  Bottom 0.3: U1.7 10.23,8.25 10.5,8.25 11,7.75 11.5,7.75 12.25,7 12.75,7 v13.25,6.5
IN_2_LOW  (via drill 0.4)
  Top 0.3: U$1.30 10.5,7.75 v11.25,7
  Bottom 0.3: U1.8 10.24,7.75 10.25,7.75 11,7 v11.25,7
N$1
  Bottom 0.3: 6,6.22 U1.14 6,5.5 5.5,5 R1.1 R2.2
N$2
  Top 0.3: BALUN1.1 26.25,1.35 26.75,0.88 C5.2
N$3
  Top 0.3: JP1.1 28.52,2.48 C5.1
N$4  (via drill 0.4)
  Top 0.3: U$51.13 28,8 v28.25,8.25 28,8.5 U$51.14
  Bottom 0.3: v28.25,8.25 CB3.1
N$5
  Bottom 0.3: U$46.P$20 21.25,4 21,3.75 C_IMU_CP_1.1
N$6
  Top 0.3: U$51.29 21,7.5 CB1.1
N$7
  Bottom 0.3: U1.17 3.5,7.74 3.25,7.5 C2.2
N$8
  Top 0.3: U$51.4 24.5,4.75 23.75,4 23.75,2.75 BALUN1.4
N$9
  Top 0.3: U$51.5 25,4.75 25.75,4 25.75,2.75 BALUN1.3
N$10
  Bottom 0.3: RED_LED.C 17.15,3.5 R4.1
N$12
  Bottom 0.3: GREEN_LED.C 14.65,3.5 R5.1
N$14
  Bottom 0.3: BLUE_LED.C 12.15,3.5 R6.1
N$17
  Bottom 0.3: YELLOW_LED.C 19.65,3.5 R7.1
PA1  (via drill 0.4)
  Top 0.3: U$1.11 17.5,9.75 17,10.25 v16.75,10.25
  Bottom 0.3: v16.75,10.25 17,10.5 17,12.5 17.5,13 TP6.TP
PA2  (via drill 0.4)
  Top 0.3: U$1.12 v17.75,11
  Bottom 0.3: v17.75,11 17.75,12.5 18.75,13.5 TP7.TP
RED_LED  (via drill 0.4)
  Top 0.3: v14.88,0.88 14.88,1.12 13.75,2.25 U$1.42
  Bottom 0.3: RED_LED.A 16,1.5 15.38,0.88 v14.88,0.88
REGOUT_1
  Bottom 0.3: U$46.P$10 28.4,4.5 C_IMU_FILT_1.1
USB_D+
  Top 0.3: U$56.P$3 6,7.5 7.25,6.25 U$1.33
USB_D-
  Top 0.3: U$56.P$2 6,8.5 7.75,6.75 U$1.32
V+  (via drill 0.4)
  Top 0.3: 3,12 3,7.25 2.75,7 2.75,5.5 3.75,4.5 U$56.P$6 6.25,4.5 v6.5,4.25 | 3,12 JP2.2 3.75,14.25 D2.C | D1.C 3,12
  Bottom 0.3: U1.18 5.5,8.25 5.62,8.75 | U1.20 6,9.25 5.5,9.25 5.62,8.75 | U1.9 9.74,7.25 | U1.10 | U1.9 U1.10 | R9.2 14.35,7.15 14.35,6.6 13.5,5.75 10.75,5.75 | U1.9 | 10.75,5.75 10.75,6 10,6.75 U1.10 | 10.75,5.75 9.5,4.5 8.25,4.5 8,4.25 v6.5,4.25 | U1.19 5.62,8.75
  Bottom 1.25: C3.1 2.95,9 C4.1 3,12 JP2.2
  Bottom 1.33: 5.62,8.75 3.62,8.75 C3.1
VOLT_SENSE  (via drill 0.4)
  Top 0.3: U$1.28 v12.25,8.75
  Bottom 0.3: v12.25,8.75 14.12,8.75 14.25,8.88 R9.1 14.38,9 14.38,10.25 14.6,10.47 R10.2
YELLOW_LED  (via drill 0.4)
  Top 0.3: v17,0.88 16.62,1.25 15.5,1.25 14.25,2.5 U$1.43
  Bottom 0.3: YELLOW_LED.A 18.5,1.5 17.88,0.88 v17,0.88
ZIG_IRQ
  Top 0.3: U$1.13 21.75,11.75 23,10.5 U$51.24
ZIG_MISO
  Top 0.3: U$51.20 25,12.25 24.75,12.5 24.75,14 24.5,14.25 15.75,14.25 15.5,14 15.5,12.75 15.25,12.5 U$1.16
ZIG_MOSI  (via drill 0.4)
  Top 0.3: U$1.17 14.75,12.75 v14.69,12.94 | v16.25,13.5 16.5,13.75 22.25,13.75 23.5,12.5 23.5,11.5 24,11 U$51.22
  Route15 0.3: v14.69,12.94 15.25,13.5 v16.25,13.5
ZIG_SCK  (via drill 0.4)
  Top 0.3: U$1.15 v15.75,10.5 | U$51.19 25.5,10.75 v25.75,11.12
  Route15 0.3: v25.75,11.12 25.75,11.25 23.25,13.75 17.5,13.75 16.5,12.75 16,12.75 15.75,12.5 v15.75,10.5
ZIG_SS
  Top 0.3: U$1.14 16.25,12.5 16.5,12.75 17.75,12.75 18.25,13.25 22,13.25 23,12.25 23,11.25 23.5,10.75 U$51.23

### Text on the board
tValues: - | + | JST SH | BALUN
tDocu: DC | Coax | Paulos | 5A
bDocu: + | JP | 5V